# Altium schematic sheet v007 schematics.SCHDOC
size C
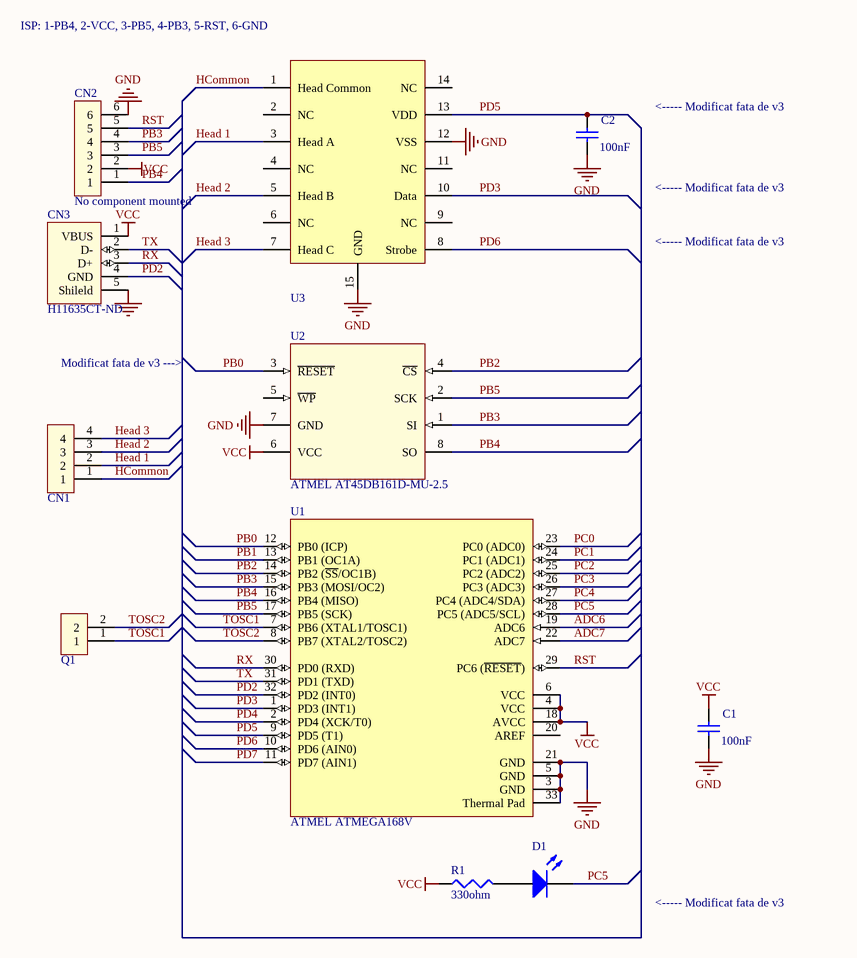
[diagram p0: v007 schematics.SCHDOC]

## Parts
C1  value 100nF  [CC0603(0201)]  (hidden comment: 490-3167-1-ND)
C2  value 100nF  [CC0603(0201)]  (hidden comment: 490-3167-1-ND)
CN1  No component mounted  [SU04LS]  (value not drawn)
CN2  No component mounted  [SU06LST]
CN3  H11635CT-ND  [Micro USB Receptacle small]
D1  511-1615-1-ND  [CC1005(0402)]  (value not drawn)
Q1  535-9542-1-ND  [Quartz SMD (small)]  (value not drawn)
R1  value 330ohm  [CC0603(0201)]  (hidden comment: P330AGCT-ND)
U1  ATMEL ATMEGA168V  [32M1-A L 3]
U2  ATMEL AT45DB161D-MU-2.5  [8m1-a mlf 2]
U3  Delta Asic  [delta asic - 4]  (value not drawn)

## Nets
GND: C1.2 C2.2 CN2.6 CN3.5(Shileld) U1.3(GND) U1.5(GND) U1.21(GND) U1.33(Thermal_Pad) U2.7(GND) U3.12(VSS) U3.15(GND)
VCC: C1.1 CN2.2 CN3.1(VBUS) R1.1 U1.4(VCC) U1.6(VCC) U1.18(AVCC) U2.6(VCC)
ADC6: U1.19(ADC6)
ADC7: U1.22(ADC7)
HCommon: CN1.1 U3.1(Head_Common)
Head 1: CN1.2 U3.3(Head_A)
Head 2: CN1.3 U3.5(Head_B)
Head 3: CN1.4 U3.7(Head_C)
PB0: U1.12(PB0_(ICP)) U2.3(~{RESET})
PB1: U1.13(PB1_(OC1A))
PB2: U1.14(PB2_(~{SS}/OC1B)) U2.4(~{CS})
PB3: CN2.4 U1.15(PB3_(MOSI/OC2)) U2.1(SI)
PB4: CN2.1 U1.16(PB4_(MISO)) U2.8(SO)
PB5: CN2.3 U1.17(PB5_(SCK)) U2.2(SCK)
PC0: U1.23(PC0_(ADC0))
PC1: U1.24(PC1_(ADC1))
PC2: U1.25(PC2_(ADC2))
PC3: U1.26(PC3_(ADC3))
PC4: U1.27(PC4_(ADC4/SDA))
PC5: D1.2(K) U1.28(PC5_(ADC5/SCL))
PD2: CN3.4(GND) U1.32(PD2_(INT0))
PD3: U1.1(PD3_(INT1)) U3.10(Data)
PD4: U1.2(PD4_(XCK/T0))
PD5: C2.1 U1.9(PD5_(T1)) U3.13(VDD)
PD6: U1.10(PD6_(AIN0)) U3.8(Strobe)
PD7: U1.11(PD7_(AIN1))
RST: CN2.5 U1.29(PC6_(~{RESET}))
RX: CN3.3(D+) U1.30(PD0_(RXD))
TOSC1: Q1.1 U1.7(PB6_(XTAL1/TOSC1))
TOSC2: Q1.2 U1.8(PB7_(XTAL2/TOSC2))
TX: CN3.2(D-) U1.31(PD1_(TXD))
NetD1_1: D1.1(A) R1.2

Not connected (* = marked no-connect by the designer): U1 20(AREF); U2 5(~{WP}); U3 2(NC) 4(NC) 6(NC) 9(NC) 11(NC) 14(NC)

## Notes on the sheet
- ISP: 1-PB4, 2-VCC, 3-PB5, 4-PB3, 5-RST, 6-GND
- <----- Modificat fata de v3
- Modificat fata de v3 --->

## Library data of the parts
C1 = Cap: Capacitor 100nf; Published: 8-Jun-2000; Revision: July-2002: Re-released for DXP Platform.; Publisher: Altium Limited
C2 = Cap: Capacitor 100nF; Published: 8-Jun-2000; Revision: July-2002: Re-released for DXP Platform.; Publisher: Altium Limited
CN1 = 4pin smd
CN2 = 6pin smd
CN3 = micro usb: CONN RCPT MICRO USB AB SMD R/A
D1 = LED3: Typical BLUE SiC LED; Revision 1: Jul-2002: Re-released for DXP Platform.; Revision 2: 17-Dec-2003: PCB Footprint replaced.; Published: 8-Jun-2000; Publisher: Altium Limited
Q1 = 2pin smd: 32.768khz crystal 1.5 x 3.2mm; alternatives: ECS Inc ECS-.327-12.5-34B
R1 = Res3: Resistor 330ohm; Published: 8-Jun-2000; Revision: July-2002: Re-released for DXP Platform.; Publisher: Altium Limited
U1 = ATmega8L-8MC: 8-Bit AVR Microcontroller; Published: 26-May-2004; LatestRevisionDate: 13-Apr-2006; LatestRevisionNote: IPC-7351 Footprint Added.; DatasheetVersion: 2486H-AVR-09/02; PackageVersion: revB, Aug-2001; PackageReference: 32M1-A; Publisher: Altium Limited; PackageDescription: 32-Pin Quad Flat No-Lead 0.5 mm Pitch; Code_JEDEC: MO-220-VHHD-2; ComponentLink1Description: Manufacturer Link; ComponentLink1URL: http://www.atmel.com; ComponentLink2Description: Datasheet; ComponentLink2URL: http://www.atmel.com/dyn/resources/prod_documents/doc2486.pdf
U2 = at45db041b: ATMEL 16MBit DataFlash
U3 = delta asic 3volt